# Altium schematic sheet heaters-connectors.SchDoc
size A4
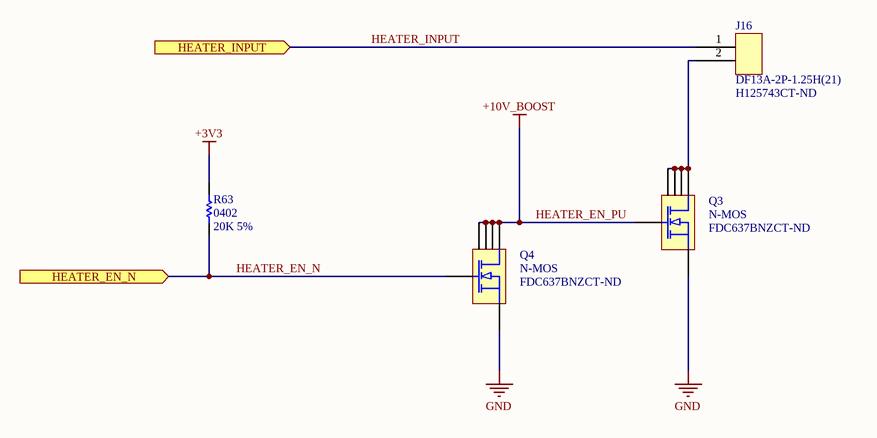
[diagram p0: heaters-connectors.SchDoc]

## Parts
J16  DF13A-2P-1.25H(21)  Supplier Part Number 1: H125743CT-ND  [DF13A-2P-1.25H(21)]
Q3  N-MOS  [SOT95P280X145-6N]
Q4  N-MOS  [SOT95P280X145-6N]
R63  0402  value 20K 5%  [RES0402R]

## Ports
HEATER_EN_N (in), HEATER_INPUT (in)

## Nets
+3V3: R63.2
GND: Q3.4(S) Q4.4(S)
HEATER_EN_PU: Q3.3(G) Q4.1(D) Q4.2(D) Q4.5(D) Q4.6(D)  [also labelled +10V_BOOST]
HEATER_EN_N: Q4.3(G) R63.1 ; port HEATER_EN_N
HEATER_INPUT: J16.1 ; port HEATER_INPUT
NetJ16_2: J16.2 Q3.1(D) Q3.2(D) Q3.5(D) Q3.6(D)

## Library data of the parts
J16 = DF13A-2P-1.25H(21): 2 pos DF13 right angle surface mount connector; Supplier 1: Digi-Key
Q3 Q4 = FDC637BNZCT-ND: 20V 6.2A, N-MOS, low gate on voltage; Supplier 1: Digi-Key; Supplier Part Number 1: FDC637BNZCT-ND
R63 = RES0402: 0402 resistor